# EasyEDA Pro project 基于ASM1153E的TYPEC接口的MSATA硬盘盒子.eprj, board PCB1_1
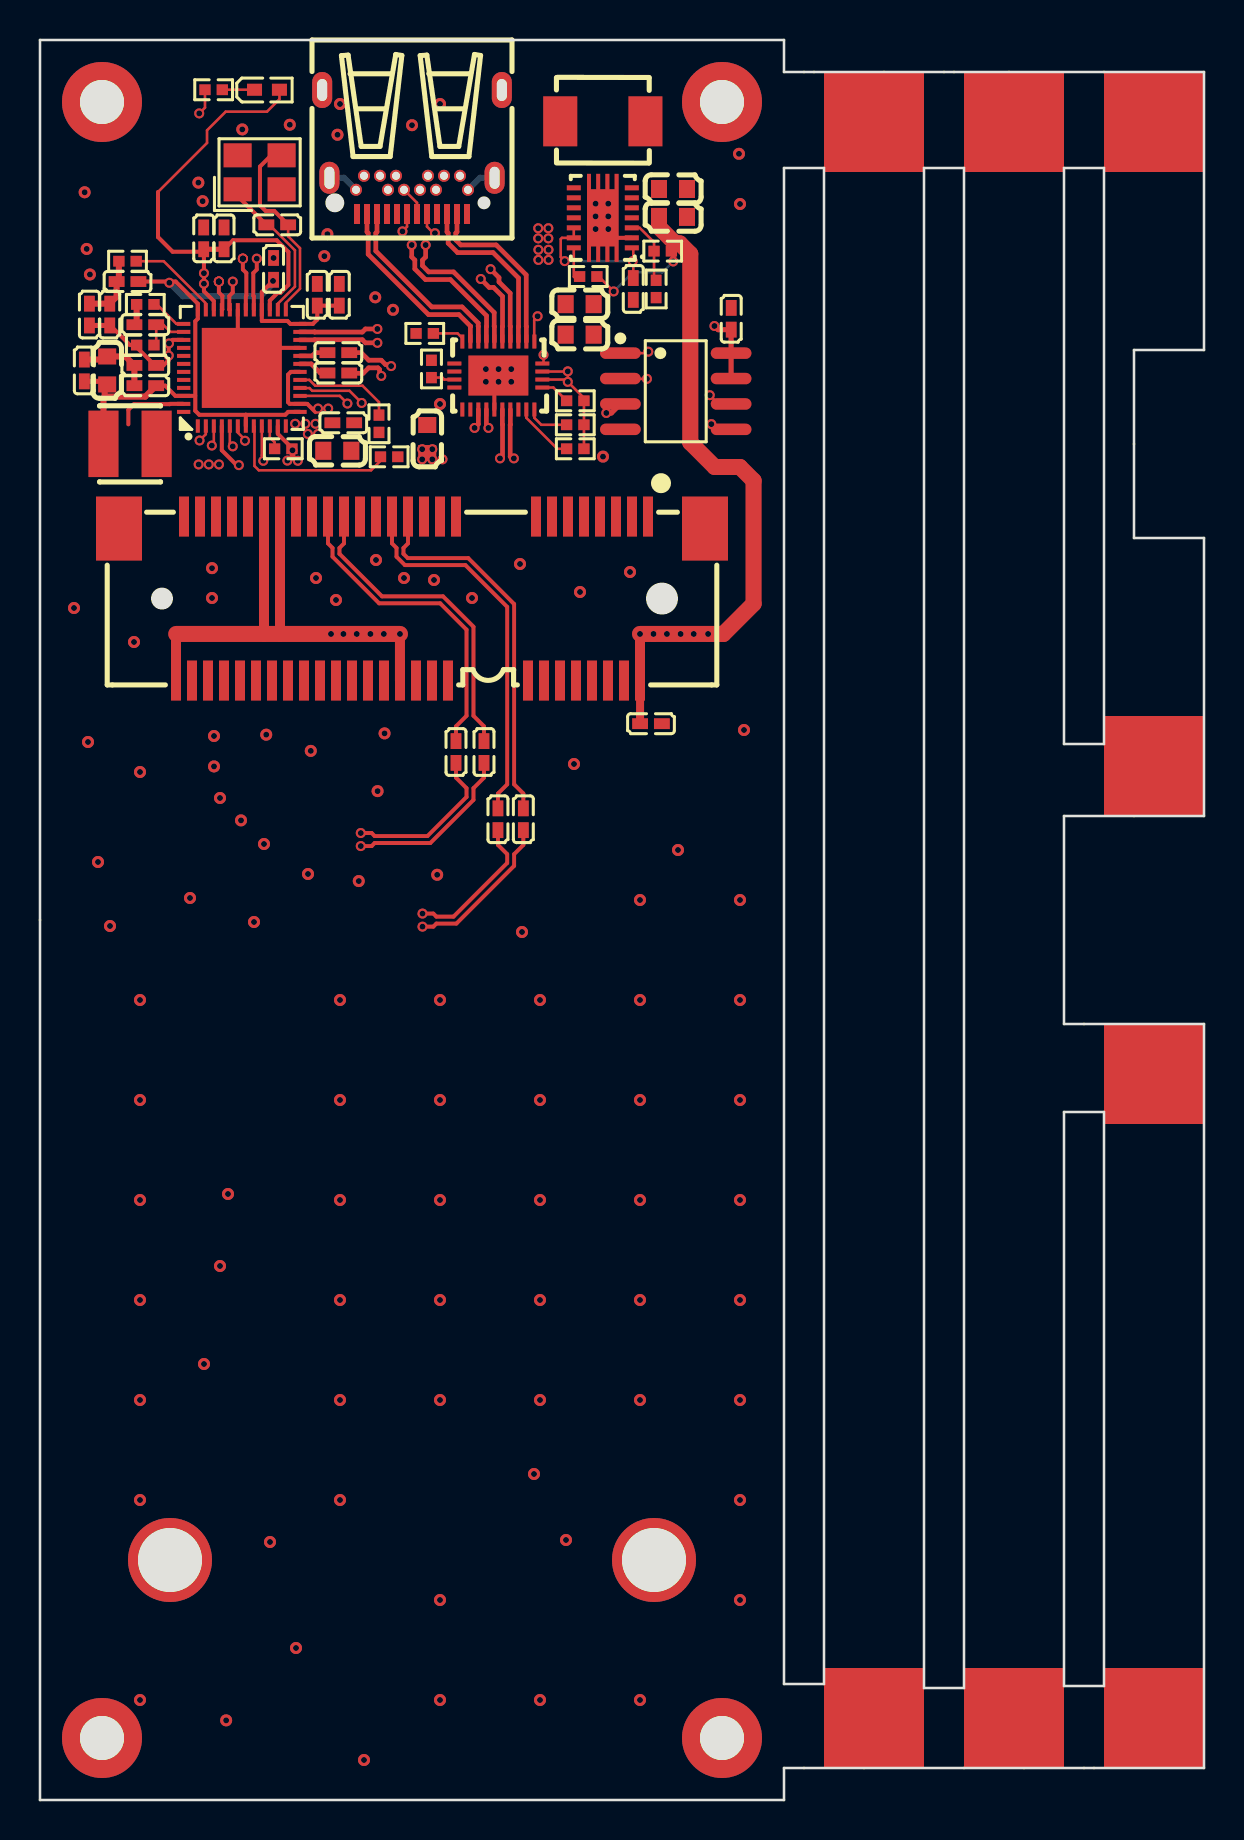
[diagram p5: board, top side]
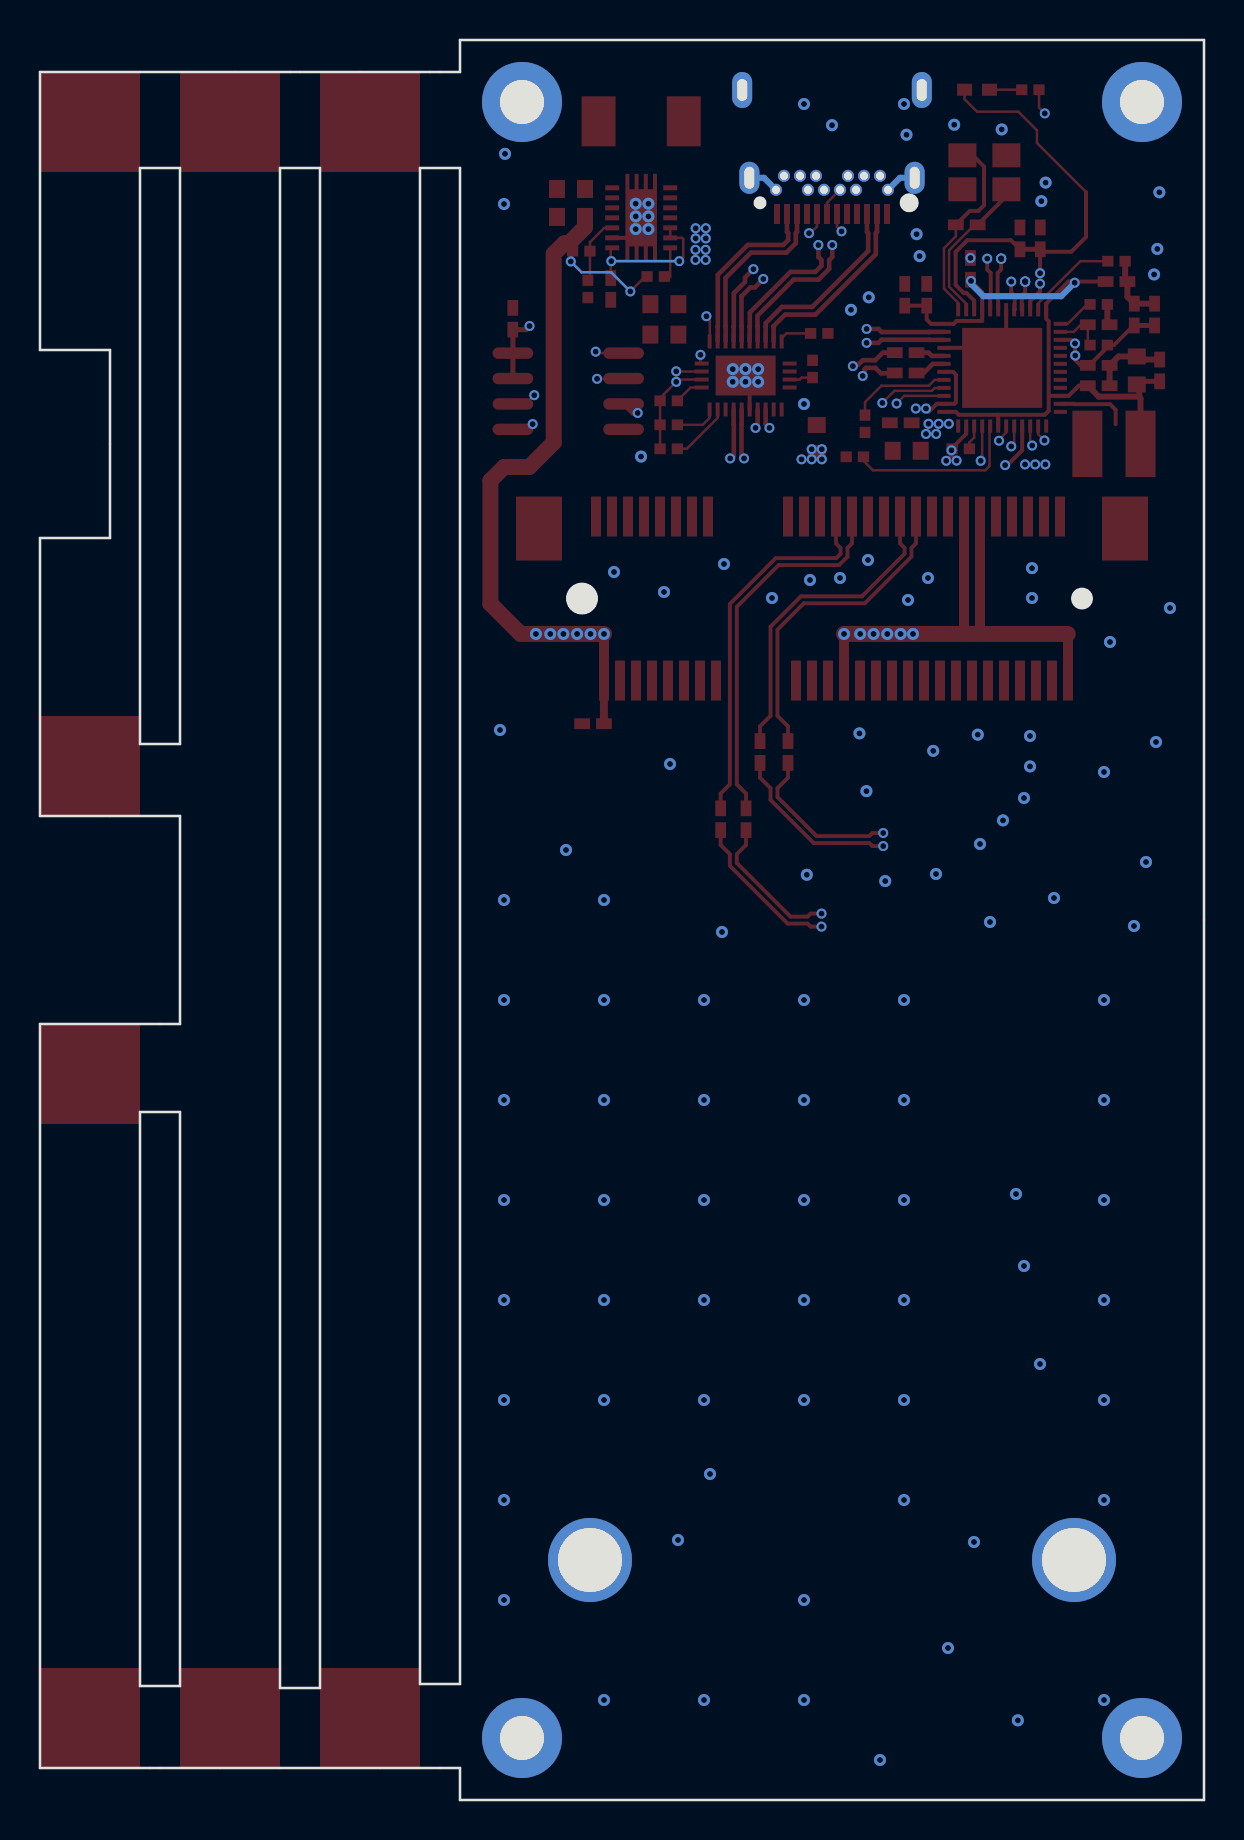
[diagram p6: board, bottom side, seen from below]

Outline 58.2 x 88 mm; copper layers: Top Layer, Inner1, Inner2, Bottom Layer. Coordinates in mm from the lower left corner of the outline.
Outline path: 0,88 0,0 37.2,0 37.2,1.6 58.2,1.6 58.2,38.8 51.2,38.8 51.2,49.2 58.2,49.2 58.2,63.1 54.7,63.1 54.7,72.5 58.2,72.5 58.2,86.4 37.2,86.4 37.2,88 0,88 ; 37.2,81.6 37.2,5.8 39.2,5.8 39.2,81.6 37.2,81.6 ; 44.2,81.6 44.2,5.6 46.2,5.6 46.2,81.6 44.2,81.6 ; 51.2,81.6 53.2,81.6 53.2,52.8 51.2,52.8 51.2,81.6 ; 51.2,34.4 53.2,34.4 53.2,5.7 51.2,5.7 51.2,34.4
Stack: Top Layer 0.035mm / Dielectric1 0.48mm PP er 4.5 / Inner1 0.035mm / Dielectric2 0.48mm FR4 er 4.5 / Inner2 0.035mm / Dielectric3 0.48mm PP er 4.5 / Bottom Layer 0.035mm

## Design rules (mm)
net SSTX_P: DP7
net SSTX_N: DP7
net SSRX_P: DP5
net SSRX_N: DP5
net RX2_P: DP1
net RX2_N: DP1
net RX1_N: DP3
net RX1_P: DP3
net TX2_P: DP4
net TX2_N: DP4
net TX1_N: DP2
net TX1_P: DP2
net CHIP_SSTX_N: DP6
net CHIP_SSTX_P: DP6
net CHIP_SATA_RX_P: DP9
net CHIP_SATA_RX_N: DP9
net CHIP_SATA_TX_N: DP8
net CHIP_SATA_TX_P: DP8
net SATA_TX_P: DP10
net SATA_TX_N: DP10
net SATA_RX_N: DP12
net SATA_RX_P: DP12
spacing safeClearance (default): track to track 0.127, other pairs 0 to 0.127
track width trackWidth (default): min 0.127, default 0.254, max 2.54
differential pair differentialPair (default): width min 0.127, default 0.254, max 2.54; gap min 0.152, default 0.152
via viaSize (default): diameter min 0.5, default 0.61, max 10; hole min 0.3, default 0.305, max 6
net GND uses 地发散

## Placement (name value [footprint] x y rotation side)
C1  100nF  [C0402]  13.86 75.26 90 top
C2  100nF  [C0402]  11.68 76.56 90 top
C3  100nF  [C0402]  5.27 70.72 180 top
C4  100nF  [C0402]  2.22 71.48 90 top
C5  100nF  [C0402]  4.38 75.92 180 top
C6  100nF  [C0402]  14.96 75.26 90 top
C7  100nF  [C0402]  2.47 74.27 90 top
C8  100nF  [C0402]  3.49 74.27 90 top
C9  100nF  [C0402]  8.19 78.08 90 top
C10  100nF  [C0402]  9.2 78.08 90 top
C11  100nF  [C0402]  34.56 74.06 90 top
C12  100nF  [C0402]  5.27 71.73 180 top
C14  10uF  [C0603]  3.36 71.48 270 top
C15  10uF  [C0603]  14.86 67.46 180 top
C16  10uF  [C0603]  19.36 68.05 270 top
C17  100nF  [C0402]  14.92 72.37 0 top
C18  100nF  [C0402]  14.92 71.35 0 top
C19  100nF  [C0402]  20.8 52.4 90 top
C20  100nF  [C0402]  22.2 52.4 90 top
C21  100nF  [C0402]  22.9 49.04 90 top
C22  100nF  [C0402]  24.17 49.04 90 top
C23  1uF  [C0402]  5.27 73.76 0 top
C24  10pF  [C0402]  11.86 78.76 0 top
C25  100nF  [C0402]  15.16 68.86 0 top
C26  100nF  [C0402]  29.66 75.55 90 top
C27  100nF  [C0402]  30.55 53.82 180 top
C28  22uF  [C0603]  31.65 80.55 180 top
C29  22uF  [C0603]  31.65 79.15 180 top
C30  22uF  [C0603]  26.98 73.27 180 top
C31  22uF  [C0603]  26.98 74.79 180 top
L1  4.7uH  [IND-SMD_L3.0-W3.0-1]  4.5 67.81 180 top
L2  1.5uH  [IND-SMD_L4.8-W4.2]  28.14 83.93 180 top
LED1  VLMW1500-GS08  [LED0402-R-RD_WHITE]  11.35 85.51 0 top
NOREF  -  [Pad_e8294]  48.7 83.9 270 top
NOREF#2  -  [Pad_e8292]  41.7 4.1 90 top
NOREF#3  -  [Pad_e3162]  3.1 84.9 180 top
NOREF#4  -  [Pad_e4877]  34.1 3.1 0 top
NOREF#5  -  [Pad_e6]  30.7 12 0 top
NOREF#6  -  [Pad_e8279]  55.7 83.9 270 top
NOREF#7  -  [Pad_e8272]  55.7 36.3 270 top
NOREF#8  -  [Pad_e4876]  3.1 3.1 270 top
NOREF#9  -  [Pad_e3101]  34.1 84.9 90 top
NOREF#10  -  [Pad_e8291]  48.7 4.1 90 top
NOREF#11  -  [Pad_e8278]  55.7 51.7 90 top
NOREF#12  -  [Pad_e2]  6.5 12 0 top
NOREF#13  -  [Pad_e8293]  41.7 83.9 270 top
NOREF#14  -  [Pad_e8277]  55.7 4.1 90 top
R1  20.5kΩ  [R0402]  19.24 73.33 0 top
R2  10kΩ  [R0402]  19.57 71.55 270 top
R3  10kΩ  [R0402]  26.76 69.96 180 top
R4  10kΩ  [R0402]  26.76 68.76 180 top
R5  10kΩ  [R0402]  26.76 67.56 180 top
R6  1MΩ  [R0402]  27.41 76.17 0 top
R7  1MΩ  [R0402]  31.14 77.44 0 top
R8  100kΩ  [R0402]  12.16 67.56 180 top
R11  4.7kΩ  [R0402]  4.38 76.94 180 top
R12  4.7kΩ  [R0402]  5.27 74.78 180 top
R13  4.7kΩ  [R0402]  17.46 67.16 0 top
R14  12.1kΩ  [R0402]  16.95 68.81 90 top
R15  1kΩ  [R0402]  8.68 85.51 0 top
R16  100kΩ  [R0402]  5.27 72.75 180 top
R17  180kΩ  [R0402]  30.81 75.55 90 top
U1  VL160  [MQFN-28_L4.5-W3.5-P0.40-BL-EP]  22.92 71.22 180 top
U2  ASM1153E  [QFN-48_L6.0-W6.0-P0.40-BL-EP4.2]  10.09 71.6 0 top
U3  PCIE-52P70H  [PCIE-SMD_52P-P0.80_PCIE-52PXXH]  18.6 60.07 180 top
U4  MX25L512EMI-10G  [SOP-8_L5.0-W4.0-P1.27-LS6.0-BL]  31.79 70.44 270 top
U5  TPS63020DSJR  [VSON-14_L4.0-W3.0-P0.50-BL-EP_TI_DSJ]  28.14 79.11 90 top
USB1  U262-241N-4BV60  [USB-C-SMD_U262-241N-4BV60]  18.6 82.4 180 top
X1  25MHz  [CRYSTAL-SMD_4P-L3.2-W2.5-BL]  10.98 81.38 0 top

## Footprints (pads in the part's own frame, mm; a bottom-side part is the same pattern mirrored in y, then rotated)
C0402
  rect 0.79x0.54 smd: 1(-0.545,0) 2(0.545,0)
C0603
  rect 0.8x0.9 smd: 1(-0.7,0) 2(0.7,0)
CRYSTAL-SMD_4P-L3.2-W2.5-BL
  rect 1.4x1.2 smd: 1(-1.1,-0.85) 2(1.1,-0.85) 3(1.1,0.85) 4(-1.1,0.85)
IND-SMD_L3.0-W3.0-1
  rect 1.501x3.32 smd: 1(1.329,0) 2(-1.329,0)
IND-SMD_L4.8-W4.2
  rect 1.7x2.499 smd: 1(-2.131,0) 2(2.128,0)
LED0402-R-RD_WHITE
  rect 0.75x0.6 smd: 1(0.623,0) 2(-0.623,0)
MQFN-28_L4.5-W3.5-P0.40-BL-EP
  rect 0.201x0.701 smd: 1(-1.801,-1.7) 2(-1.399,-1.7) 3(-1.001,-1.7) 4(-0.6,-1.7) 5(-0.201,-1.7) 6(0.201,-1.7) 7(0.6,-1.7) 8(1.001,-1.7) 9(1.399,-1.7) 10(1.801,-1.7) 15(1.801,1.7) 16(1.399,1.7) 17(1.001,1.7) 18(0.6,1.7) 19(0.201,1.7) 20(-0.201,1.7) 21(-0.6,1.7) 22(-1.001,1.7) 23(-1.399,1.7) 24(-1.801,1.7)
  rect 0.701x0.201 smd: 11(2.2,-0.6) 12(2.2,-0.201) 13(2.2,0.201) 14(2.2,0.6) 25(-2.2,0.6) 26(-2.2,0.201) 27(-2.2,-0.201) 28(-2.2,-0.6)
  rect 2.999x1.999 smd: 29(0,0)
Pad_e2
  round 4.2 hole 3.2: 1(0,0)
Pad_e6
  round 4.2 hole 3.2: 2(0,0)
Pad_e3101
  round 4 hole 2.2: 3(0,0)
Pad_e3162
  round 4 hole 2.2: 4(0,0)
Pad_e4876
  round 4 hole 2.2: 4(0,0)
Pad_e4877
  round 4 hole 2.2: 3(0,0)
Pad_e8272
  rect 5x5 smd: 16(0,0)
Pad_e8277
  rect 5x5 smd: 15(0,0)
Pad_e8278
  rect 5x5 smd: 14(0,0)
Pad_e8279
  rect 5x5 smd: 15(0,0)
Pad_e8291
  rect 5x5 smd: 16(0,0)
Pad_e8292
  rect 5x5 smd: 17(0,0)
Pad_e8293
  rect 5x5 smd: 18(0,0)
Pad_e8294
  rect 5x5 smd: 19(0,0)
PCIE-SMD_52P-P0.80_PCIE-52PXXH
  rect 0.5x2 smd: 1(-11.8,-4.1) 2(-11.4,4.1) 3(-11,-4.1) 4(-10.6,4.1) 5(-10.2,-4.1) 6(-9.8,4.1) 7(-9.4,-4.1) 8(-9,4.1) 9(-8.6,-4.1) 10(-8.2,4.1) 11(-7.8,-4.1) 12(-7.4,4.1) 13(-7,-4.1) 14(-6.6,4.1) 15(-6.2,-4.1) 16(-5.8,4.1) 17(-2.2,-4.1) 18(-1.8,4.1) 19(-1.4,-4.1) 20(-1,4.1) 21(-0.6,-4.1) 22(-0.2,4.1) 23(0.2,-4.1) 24(0.6,4.1) 25(1,-4.1) 26(1.4,4.1) 27(1.8,-4.1) 28(2.2,4.1) 29(2.6,-4.1) 30(3,4.1) 31(3.4,-4.1) 32(3.8,4.1) 33(4.2,-4.1) 34(4.6,4.1) 35(5,-4.1) 36(5.4,4.1) 37(5.8,-4.1) 38(6.2,4.1) 39(6.6,-4.1) 40(7,4.1) 41(7.4,-4.1) 42(7.8,4.1) 43(8.2,-4.1) 44(8.6,4.1) 45(9,-4.1) 46(9.4,4.1) 47(9.8,-4.1) 48(10.2,4.1) 49(10.6,-4.1) 50(11,4.1) 51(11.4,-4.1) 52(11.8,4.1)
  rect 2.3x3.2 smd: 53(14.65,-3.5) 54(-14.65,-3.5)
QFN-48_L6.0-W6.0-P0.40-BL-EP4.2
  rect 0.2x0.665 smd: 1(-2.2,-2.908) 2(-1.8,-2.908) 3(-1.4,-2.908) 4(-1,-2.908) 5(-0.6,-2.908) 6(-0.2,-2.908) 7(0.2,-2.908) 8(0.6,-2.908) 9(1,-2.908) 10(1.4,-2.908) 11(1.8,-2.908) 12(2.2,-2.908) 25(2.2,2.908) 26(1.8,2.908) 27(1.4,2.908) 28(1,2.908) 29(0.6,2.908) 30(0.2,2.908) 31(-0.2,2.908) 32(-0.6,2.908) 33(-1,2.908) 34(-1.4,2.908) 35(-1.8,2.908) 36(-2.2,2.908)
  rect 0.665x0.2 smd: 13(2.908,-2.2) 14(2.908,-1.8) 15(2.908,-1.4) 16(2.908,-1) 17(2.908,-0.6) 18(2.908,-0.2) 19(2.908,0.2) 20(2.908,0.6) 21(2.908,1) 22(2.908,1.4) 23(2.908,1.8) 24(2.908,2.2) 37(-2.908,2.2) 38(-2.908,1.8) 39(-2.908,1.4) 40(-2.908,1) 41(-2.908,0.6) 42(-2.908,0.2) 43(-2.908,-0.2) 44(-2.908,-0.6) 45(-2.908,-1) 46(-2.908,-1.4) 47(-2.908,-1.8) 48(-2.908,-2.2)
  rect 4x4 smd: 49(0,0)
R0402
  rect 0.566x0.54 smd: 1(-0.433,0) 2(0.433,0)
SOP-8_L5.0-W4.0-P1.27-LS6.0-BL
  oval 0.574x2.035 smd: 1(-1.905,-2.768) 2(-0.635,-2.768) 3(0.635,-2.768) 4(1.905,-2.768) 5(1.905,2.768) 6(0.635,2.768) 7(-0.635,2.768) 8(-1.905,2.768)
USB-C-SMD_U262-241N-4BV60
  oval 1x1.6 hole 0.5x1.1: 1(-4.13,1.29) 4(4.13,1.29)
  oval 1x1.8 hole 0.5x1.1: 2(-4.49,-3.1) 3(4.49,-3.1)
  rect 0.3x1 smd: A1(-2.75,3.1) A2(-2.25,3.1) A3(-1.75,3.1) A4(-1.25,3.1) A5(-0.75,3.1) A6(-0.25,3.1) A7(0.25,3.1) A8(0.75,3.1) A9(1.25,3.1) A10(1.75,3.1) A11(2.25,3.1) A12(2.75,3.1)
  round 0.6 hole 0.4: B1(2.8,1.89) B2(2.4,1.19) B3(1.6,1.19) B4(1.2,1.89) B5(0.799,1.19) B6(0.4,1.89) B7(-0.4,1.89) B8(-0.8,1.19) B9(-1.2,1.89) B10(-1.6,1.19) B11(-2.4,1.19) B12(-2.8,1.89)
VSON-14_L4.0-W3.0-P0.50-BL-EP_TI_DSJ
  rect 0.25x0.7 smd: 1(-1.5,-1.45) 2(-1,-1.45) 3(-0.5,-1.45) 4(0,-1.45) 5(0.5,-1.45) 6(1,-1.45) 7(1.5,-1.45) 8(1.5,1.45) 9(1,1.45) 10(0.5,1.45) 11(0,1.45) 12(-0.5,1.45) 13(-1,1.45) 14(-1.5,1.45)
  custom 4.4x1.58 smd: 15(0,0)

## Nets
As in the schematic, except:
5V: C16.2 C30.2 C31.2 R3.1 R4.1 R5.1 R8.1 U1.26 U1.27 U2.1 U2.11 U5.10 U5.11 USB1.A4 USB1.A9 USB1.B4 USB1.B9
GND: C1.2 C2.2 C3.2 C4.2 C5.2 C6.2 C7.2 C8.2 C9.2 C10.2 C11.2 C12.2 C14.1 C15.1 C16.1 C23.1 C25.2 C26.1 C27.1 C28.1 C29.1 C30.1 C31.1 NOREF.19 NOREF#2.17 NOREF#3.4 NOREF#4.3 NOREF#5.2 NOREF#6.15 NOREF#7.16 NOREF#8.4 NOREF#9.3 NOREF#10.16 NOREF#11.14 NOREF#12.1 NOREF#13.18 NOREF#14.15 R1.1 R2.1 R11.2 R12.2 R13.2 R14.1 R17.1 U1.19 U1.29 U2.21 U2.31 U2.47 U2.49 U3.4 U3.9 U3.15 U3.18 U3.21 U3.26 U3.27 U3.29 U3.34 U3.35 U3.37 U3.40 U3.43 U3.50 U3.53 U3.54 U4.4 U5.2 U5.15 USB1.1 USB1.2 USB1.3 USB1.4 USB1.A1 USB1.A12 USB1.B1 USB1.B12 X1.2 X1.4

Pads without a net: U1 11 12 14 15 16 22; U2 40 41 42 43 44 45; U3 1 3 5 6 7 8 10 11 12 13 14 16 17 19 20 22 28 30 32 36 38 42 44 45 46 47 48 49 51; USB1 A8 B8

## Via types
v1: diameter 0.6, hole 0.3, Top Layer to Bottom Layer, 128 vias
v2: diameter 0.5, hole 0.3, Top Layer to Bottom Layer, 85 vias

## Routing (per net, layer and track width the routed paths; a pad name or vN(x,y) marks a point on that pad's centre or on a via; arc(x,y) is an arc through that point)
3V3: length 65.9
  Top Layer w0.127: R6.2 27.94,76.17 v2(28.68,75.43)
  Top Layer w0.254: R7.2 31.66,77.35 v2(31.66,76.93)
  Top Layer w0.4: C27.2 30,55.97 U3.2
  Top Layer w0.5: U3.2 v1(30,58.3) ; U3.41 11.2,58.3 11.2,58.3 ; 6.81,58.3 6.8,58.29 U3.52 ; v1(18,58.3) 18,55.97 U3.24 ; 11.99,58.3 12,58.31 U3.39
  Top Layer w0.8: 6.81,58.3 v1(14.55,58.3) v1(15.17,58.3) v1(15.84,58.3) v1(16.52,58.3) v1(17.19,58.3) v1(18,58.3) ; C29.2 30.95,78.64 31.76,77.83 31.99,77.83 32.51,77.31 32.51,67.87 33.73,66.65 34.99,66.65 35.68,65.97 35.68,59.81 34.17,58.3 v1(33.4,58.3) v1(32.69,58.3) v1(32.03,58.3) v1(31.35,58.3) v1(30.67,58.3) v1(30,58.3)
  Bottom Layer w0.127: v2(28.68,75.43) 29.64,76.39 31.12,76.39 v2(31.66,76.93)
5V: length 9.3
  Top Layer w0.127: R5.1 R4.1 R3.1 27.2,70.1 v2(26.39,70.91) ; U1.27 26.38,71.42 v2(26.39,71.43) v2(26.39,70.91) ; v2(26.39,70.91) 26.27,71.02 U1.26
  Top Layer w0.2: v2(12.37,66.97) 12.62,67.23 ; v2(12.89,66.96) 12.62,67.23 v2(12.62,67.48) 12.62,67.57 11.89,68.31 U2.11
  vias: v2(7.93,66.78) v2(8.44,66.78) v2(8.95,66.78) v2(19.11,67.54) v2(19.11,67.03) v2(19.62,67.54) v2(19.62,67.03) v2(20.12,67.03) v2(24.91,78.59) v2(24.91,78.08) v2(24.92,77.51) v2(24.92,77) v2(25.42,78.59) v2(25.42,78.08) v2(25.43,77.51) v2(25.43,77)
GND: length 24.2
  Top Layer w0.2: U2.47 6.5,69.8 6.49,69.79 4.7,69.79 4.42,69.51 4.42,68.78 ; U1.29 22.72,71.02 U1.19 ; 28.52,78.47 28.89,78.11 U5.2 ; U2.21 11.09,72.6 U2.49 9.89,71.8 U2.31
  Top Layer w0.3: R12.2 4.83,73.88 C23.1 ; C3.2 C12.2 4.27,72.18 C14.1 3.2,72.02 C4.2 ; C7.2 C8.2 3.83,75.16 C5.2 3.94,76.04 3.94,76.94
  Bottom Layer w0.3: USB1.1 22,81.11 USB1.B12 ; USB1.B1 15.2,81.11 USB1.4
  vias: v1(1.7,59.6) v1(2.23,80.39) v1(2.33,77.55) v1(2.4,52.9) v1(2.5,76.28) v1(2.9,46.9) v1(3.5,43.7) v1(4.7,57.9) v1(5,51.4) v1(5,40) v1(5,35) v1(5,30) v1(5,25) v1(5,20) v1(5,15) v1(5,5) v1(7.5,45.1) v1(7.92,80.87) v1(8.13,79.94) v1(8.2,21.8) v1(8.6,61.59) v1(8.6,60.1) v1(8.7,53.2) v1(8.7,51.68) v1(9,50.1) v1(9,26.7) v1(9.31,3.98) v1(9.4,30.3) v1(10.11,83.53) v1(10.05,48.98) v1(10.7,43.9) v1(11.2,47.8) v1(11.31,53.27) v1(11.5,12.9) v1(12.49,83.76) v1(12.8,7.6) v1(13.4,46.3) v1(13.54,52.46) v1(13.8,61.1) v1(14.22,77.19) v1(14.37,78.29) v1(14.8,60) v1(14.87,83.26) v1(15,84.8) v1(15,40) v1(15,35) v1(15,30) v1(15,25) v1(15,20) v1(15,15) v1(15.94,45.95) v1(16.2,2) v1(16.76,75.13) v1(16.8,62) v1(16.88,50.44) v1(17.23,53.33) v1(17.65,74.51) v1(18.2,61.1) v1(18.6,83.74) v1(19.7,61) v1(19.86,46.26) v1(20,84.8) v1(20,69.8) v1(20,40) v1(20,35) v1(20,30) v1(20,25) v1(20,20) v1(20,10) v1(20,5) v1(21.6,60.1) v1(22.29,71.54) v1(22.29,70.91) v1(22.93,71.54) v1(22.93,70.91) v1(23.56,71.54) v1(23.56,70.91) v1(24,61.8) v1(24.1,43.4) v1(24.7,16.3) v1(25,40) v1(25,35) v1(25,30) v1(25,25) v1(25,20) v1(25,5) v1(26.3,13) v1(26.7,51.8) v1(27,60.4) v1(27.78,79.82) v1(27.78,79.18) v1(27.78,78.55) v1(28.15,67.17) v1(28.41,79.82) v1(28.41,79.18) v1(28.41,78.55) v1(29.5,61.4) v1(30,45) v1(30,40) v1(30,35) v1(30,30) v1(30,25) v1(30,20) v1(30,5) v1(31.9,47.5) v1(34.95,82.31) v1(35,79.8) v1(35,45) v1(35,40) v1(35,35) v1(35,30) v1(35,25) v1(35,20) v1(35,15) v1(35,10) v1(35.2,53.5) v2(11.68,77.1)
VBUS_DET: length 1.2
  Top Layer w0.127: R8.2 11.73,67.88 11.49,68.12 U2.10
VCC12: length 36.5
  Top Layer w0.2: 10.29,69.26 7.96,69.26 7.76,69.46 7.76,73.94 7.89,74.06 U2.36 7.89,74.81 6.78,75.92 C5.1 ; 10.29,69.26 10.29,69.26 U2.7 ; 10.29,69.26 12.26,69.26 12.41,69.4 U2.13 ; 7.76,70.2 U2.46 6.77,70.2 6.26,70.72 C3.1 ; C2.1 11.68,75.98 v2(11.65,75.95) 11.09,75.39 U2.28 11.09,73.96 11.1,73.95 12.37,73.95 12.52,73.8 13,73.8 U2.24 13.64,73.8 13.86,74.02 C1.1 C6.1
  Top Layer w0.254: C4.1 3.08,70.93 3.23,70.78
  Top Layer w0.3: C3.1 5.26,70.17 3.26,70.17 3.23,70.14 ; 3.17,68.05 3.17,70.08 3.23,70.14 ; 3.23,70.14 3.23,70.78
  Bottom Layer w0.3: v2(11.65,75.95) 11.65,75.81 11.03,75.19 7.14,75.19 v2(6.47,75.86)
VCC33: length 66.1
  Top Layer w0.127: 5.9,80.4 8.35,82.85 8.35,83.48 9.28,84.42 11.35,84.42 11.97,85.04 LED1.1
  Top Layer w0.2: 3.52,73.73 4.5,72.75 R16.2 4.83,72.64 5.74,71.73 C12.1 6.17,71.73 6.44,72 v2(6.44,72.22) 6.44,72.81 v2(6.45,72.83) 6.63,73 U2.39 ; U2.34 8.69,74.95 8.2,75.44 v2(8.2,75.81) v2(8.2,76.34) 8.2,77.53 C9.1 8.06,77.41 6.64,77.41 5.9,78.15 5.9,80.4 ; U2.18 12.54,71.4 12.4,71.26 12.4,69.89 12.49,69.8 U2.14 13.36,69.8 13.77,69.39 ; C10.1 9.65,77.99 11.83,77.99 12.42,77.4 12.42,75.75 12.02,75.36 11.88,75.36 11.49,74.97 U2.27 ; v2(9.94,66.74) 9.83,66.74 9.09,67.49 U2.4
  Top Layer w0.254: v2(33.72,73.7) 33.91,73.52 C11.1 34.55,73.51 U4.8 U4.7 ; 8.2,77.53 8.21,77.54 C10.1 ; C7.1 3.52,73.73 ; U4.3 28.57,69.35 v2(28.31,69.35)
  Inner1 w0.254: v2(13.9,68.3) 14.28,68.68 19.76,68.68 20.49,67.95 23.26,67.95 24.67,69.35 v2(28.31,69.35) 28.31,72.1 29.92,73.7 v2(33.72,73.7)
  vias: v2(12.76,68.81) v2(13.27,68.81) v2(13.39,68.3) v2(13.77,68.81) v2(13.9,69.57) v2(14.41,69.57)
CC1: length 10.3
  Top Layer w0.127: USB1.A5 19.35,78.67 19.67,78.34 v2(19.75,78.34) ; 24.72,72.92 24.71,72.93 24.71,73.99 24.88,74.16 v2(24.88,74.19)
  Inner1 w0.127: 24.88,74.19 24.72,74.35 24.72,75.96 22.56,78.11 19.98,78.11 v2(19.75,78.34)
CC2: length 17.3
  Top Layer w0.127: U1.28 25.18,71.88 v2(25.18,72.26)
  Inner1 w0.127: USB1.B5 18.43,81.84 21.2,81.84 21.6,82.24 23.36,82.24 23.95,81.65 23.95,77.08 24.97,76.06 24.97,74.72 25.32,74.37 25.32,72.4 v2(25.18,72.26)
CHIP_SATA_RX_N: length 59.8
  Top Layer w0.195: v2(19.12,44.32) 19.67,44.32 19.82,44.17 20.67,44.17 23.36,46.85 23.36,47.29 22.9,47.75 C21.1
  Top Layer w0.196: U2.30 10.29,75.19 10.32,75.21 10.32,76.35 10.14,76.52 v2(10.14,77.07)
  Inner2 w0.153: v2(19.12,44.32) 18.65,44.32 18.47,44.15 13.37,44.15 7.82,49.7 7.82,54.87 7.97,55.03 8.11,55.03 8.27,55.18 8.27,55.37 8.11,55.53 7.97,55.53 7.82,55.68 7.82,55.87 7.97,56.03 8.11,56.03 8.27,56.18 8.27,56.37 8.11,56.53 7.97,56.53 7.82,56.68 7.82,56.87 7.97,57.03 8.11,57.03 8.27,57.18 8.27,57.37 8.11,57.53 7.97,57.53 7.82,57.68 7.82,57.87 7.97,58.03 8.11,58.03 8.27,58.18 8.27,58.37 8.11,58.53 7.97,58.53 7.82,58.68 7.82,63.16 5.86,65.11 5.86,76.89 7.1,78.13 10.18,78.13 10.34,77.97 10.34,77.74 10.14,77.55 v2(10.14,77.07)
CHIP_SATA_RX_P: length 59.7
  Top Layer w0.195: C22.1 24.17,47.75 23.71,47.29 23.71,46.71 20.82,43.82 19.82,43.82 19.67,43.67 v2(19.12,43.67)
  Top Layer w0.196: v2(10.84,77.07) 10.84,76.52 10.67,76.35 10.67,75.21 10.69,75.19 U2.29
  Inner2 w0.153: v2(10.84,77.07) 10.84,77.55 10.64,77.74 10.64,78.1 10.3,78.44 6.97,78.44 5.56,77.02 5.56,64.99 7.51,63.03 7.51,49.57 13.24,43.84 18.47,43.84 18.65,43.67 v2(19.12,43.67)
CHIP_SATA_TX_N: length 48.6
  Top Layer w0.195: C20.1 22.2,51.12 21.67,50.59 21.67,50.01 19.52,47.85 16.73,47.85 16.58,47.7 v2(16.04,47.7)
  Top Layer w0.196: U2.32 9.48,74.51 9.46,74.53 9.46,75.2 9.64,75.38 v2(9.64,75.92)
  Inner2 w0.153: v2(9.64,75.92) 9.64,76.4 9.44,76.59 9.44,76.95 9.1,77.29 7.78,77.29 7.01,76.51 7.01,65.8 9.52,63.29 9.52,51 12.65,47.87 15.39,47.87 15.56,47.7 v2(16.04,47.7)
CHIP_SATA_TX_P: length 48.7
  Top Layer w0.195: C19.1 20.8,51.12 21.33,50.59 21.33,50.15 19.37,48.2 16.73,48.2 16.58,48.35 v2(16.04,48.35)
  Top Layer w0.196: U2.33 9.1,74.51 9.12,74.53 9.12,75.2 8.94,75.38 v2(8.94,75.92)
  Inner2 w0.153: v2(8.94,75.92) 8.94,76.4 9.14,76.59 9.14,76.82 8.98,76.99 7.91,76.99 7.31,76.39 7.31,65.93 9.82,63.42 9.82,58.73 9.98,58.58 10.21,58.58 10.36,58.42 10.36,58.23 10.21,58.08 9.98,58.08 9.82,57.92 9.82,57.73 9.98,57.58 10.21,57.58 10.36,57.42 10.36,57.23 10.21,57.08 9.98,57.08 9.82,56.92 9.82,56.73 9.98,56.58 10.21,56.58 10.36,56.42 10.36,56.23 10.21,56.08 9.98,56.08 9.82,55.92 9.82,51.13 12.78,48.17 15.39,48.17 15.56,48.35 v2(16.04,48.35)
CHIP_SSTX_N: length 1.6
  Top Layer w0.231: U2.19 13.56,71.8 14.01,71.35 C18.1
CHIP_SSTX_P: length 1.4
  Top Layer w0.231: C17.1 13.77,72.37 13.61,72.2 U2.20
D+: length 16.1
  Top Layer w0.127: USB1.A6 18.85,79.86 USB1.B6 ; v2(15.37,69.82) 14.99,70.2 U2.15
  Inner1 w0.127: USB1.B6 18.51,80.2 18.51,79.44 15.58,76.52 15.58,70.04 v2(15.37,69.82)
D-: length 16.6
  Top Layer w0.127: U2.16 13.01,70.6 13.48,70.6 13.61,70.46 15.48,70.46 v2(16.08,69.85) ; USB1.A7 18.35,78.66 v2(18.12,78.43)
  Inner1 w0.127: USB1.B7 18.76,80.27 18.76,79.32 18.12,78.68 v2(18.12,78.43) 17.87,78.43 15.84,76.4 15.84,70.1 v2(16.08,69.85)
GPIO2: length 25.4
  Top Layer w0.127: v2(11.16,66.96) 11.16,67.16 11.09,67.23 U2.9 ; v2(7.96,84.33) 8.25,84.62 R15.1
  Inner1 w0.127: v2(7.96,84.33) 7.46,83.83 7.46,82.9 5.18,80.61 5.18,76.61 4.93,76.36 4.93,72.28 8.19,69.01 10.08,69.01 11.16,67.93 v2(11.16,66.96)
GPIO3: length 8.8
  Top Layer w0.127: R13.1 17.02,66.96 16.55,66.49 10.94,66.49 10.72,66.7 10.72,68.66 U2.8
GPIO4: length 40.7
  Top Layer w0.127: v2(10.25,67.96) 10.25,68.01 9.89,68.37 U2.6 ; U4.1 30.34,72.34 v2(30.42,72.42)
  Inner1 w0.127: v2(30.42,72.42) 30.79,72.04 30.79,70.87 30.41,70.5 30.41,67.02 26.25,62.86 9.41,62.86 6.53,65.75 6.53,67.25 7.7,68.42 9.8,68.42 v2(10.25,67.96)
GPIO5: length 44.3
  Top Layer w0.127: v2(33.57,68.79) 33.83,68.53 34.55,68.53 ; U2.5 9.49,67.83 v2(9.64,67.68)
  Inner1 w0.127: v2(33.57,68.79) 33.93,69.16 33.93,72.18 33,73.11 30.13,73.11 29.65,72.64 29.65,67.34 25.94,63.63 9.73,63.63 7.29,66.06 7.29,66.93 7.58,67.22 9.18,67.22 v2(9.64,67.68)
GPIO6: length 1.9
  Top Layer w0.127: R12.1 5.84,74.78 6.82,73.8 U2.37
GPIO7: length 4.7
  Top Layer w0.127: U2.35 8.26,74.54 8.26,74.86 6.19,76.94 R11.1
I2C_CLK: length 42
  Top Layer w0.127: U2.3 8.69,67.82 v2(8.59,67.72) ; U4.6 33.93,69.8 v2(33.49,70.24)
  Inner1 w0.127: v2(8.59,67.72) 8.34,67.47 7.47,67.47 7.04,67.04 7.04,65.96 9.62,63.37 26.04,63.37 29.91,67.24 29.91,72.53 30.23,72.86 32.89,72.86 33.46,72.28 33.46,70.26 v2(33.49,70.24)
I2C_DATA: length 35.2
  Top Layer w0.127: U4.2 29.03,71.06 v2(30.35,71.06) ; v2(7.98,67.98) 8.29,68.29 U2.2
  Inner1 w0.127: v2(30.35,71.06) 30.16,70.87 30.16,67.13 26.15,63.12 9.52,63.12 6.78,65.85 6.78,67.15 7.62,67.98 v2(7.98,67.98)
RST#: length 2.6
  Top Layer w0.127: U2.38 6.52,73.4 6.16,73.76 C23.2 5.81,72.86 R16.1
RX1_N: length 11.9
  Top Layer w0.231: v2(18.59,77.75) 18.59,77.15 18.74,77 18.74,76.55 19.27,76.02 20.52,76.02 22.33,74.21 22.33,73.68 22.32,73.67 U1.7
  Inner2 w0.18: USB1.B10 20.29,81.21 20.43,81.08 20.43,79.93 19.84,79.35 19.08,79.35 18.78,79.04 18.78,77.94 v2(18.59,77.75)
RX1_P: length 11.9
  Top Layer w0.231: U1.6 22.72,73.67 22.71,73.68 22.71,74.37 20.68,76.4 19.43,76.4 19.13,76.71 19.13,77 19.28,77.15 v2(19.28,77.75)
  Inner2 w0.18: USB1.B11 20.87,81.21 20.76,81.1 20.76,79.79 19.98,79.01 19.22,79.01 19.11,78.9 19.11,77.92 v2(19.28,77.75)
RX2_N: length 9.4
  Top Layer w0.231: U1.8 21.92,73.67 21.91,73.68 21.91,73.85 21.11,74.65 19.58,74.65 16.79,77.45 16.79,78.34 16.85,78.4 USB1.A10
RX2_P: length 9.4
  Top Layer w0.231: U1.9 21.52,73.67 21.53,73.68 21.53,73.69 20.95,74.27 19.43,74.27 16.41,77.29 16.41,78.34 16.35,78.4 USB1.A11
SATA_RX_N: length 18.9
  Top Layer w0.195: C21.2 22.9,50.32 23.36,50.78 23.36,59.65 21.27,61.75 18.25,61.75 17.83,62.17 17.83,62.6 17.6,62.83 U3.25
SATA_RX_P: length 18.9
  Top Layer w0.195: C22.2 24.17,50.32 23.71,50.78 23.71,59.8 21.41,62.09 18.39,62.09 18.17,62.31 18.17,62.6 18.4,62.83 U3.23
SATA_TX_N: length 16.1
  Top Layer w0.195: C20.2 22.2,53.68 21.67,54.21 21.67,58.66 20.15,60.18 17.1,60.18 14.97,62.31 14.97,62.6 15.2,62.83 U3.31
SATA_TX_P: length 16.1
  Top Layer w0.195: U3.33 14.4,62.83 14.63,62.6 14.63,62.17 16.96,59.83 20.01,59.83 21.33,58.52 21.33,54.21 20.8,53.68 C19.2
SSRX_N: length 12.2
  Top Layer w0.231: U1.17 21.92,68.79 v2(21.73,68.6) ; U2.22 13.73,73 13.74,73.01 16.12,73.01 16.27,72.86 v2(16.87,72.86)
  Inner2 w0.18: v2(16.87,72.86) 17.41,72.86 17.59,73.04 17.87,73.04 21.9,69.01 21.9,68.68 21.82,68.6 v2(21.73,68.6)
SSRX_P: length 12.7
  Top Layer w0.231: v2(22.42,68.6) 22.32,68.71 U1.18 ; U2.23 13.73,73.4 13.74,73.4 16.12,73.4 16.27,73.55 v2(16.87,73.55)
  Inner2 w0.18: v2(22.42,68.6) 22.36,68.6 22.23,68.73 22.23,69.14 18.01,73.37 17.59,73.37 17.41,73.55 v2(16.87,73.55)
SSTX_N: length 12.6
  Top Layer w0.231: v2(17.06,71.2) 16.98,71.29 16.98,71.53 16.9,71.61 16.43,71.61 16.16,71.34 15.48,71.34 C18.2 ; U1.20 23.12,68.78 23.13,68.77 23.13,67.14 23.06,67.08 v2(23,67.08)
  Inner2 w0.18: v2(23,67.08) 23,67.14 23.18,67.31 22.87,67.62 20.89,67.62 17.68,70.82 17.45,70.82 v2(17.06,71.2)
SSTX_P: length 13.3
  Top Layer w0.231: v2(23.69,67.08) 23.6,67.08 23.51,67.17 23.51,68.77 23.52,68.78 U1.21 ; v2(17.56,71.69) 17.48,71.77 17.28,71.77 17.06,71.99 16.43,71.99 16.06,72.37 C17.2
  Inner2 w0.18: v2(17.56,71.69) 17.94,71.31 17.94,71.03 21.02,67.95 23.01,67.95 23.55,67.41 23.55,67.22 v2(23.69,67.08)
TX1_N: length 8.9
  Top Layer w0.231: U1.3 23.92,73.67 23.93,73.68 23.93,76.1 22.65,77.37 20.88,77.37 20.41,77.84 20.41,78.34 20.35,78.4 USB1.A3
TX1_P: length 8.9
  Top Layer w0.231: U1.2 24.32,73.67 24.31,73.68 24.31,76.26 22.81,77.75 21.04,77.75 20.79,78 20.79,78.34 20.85,78.4 USB1.A2
TX2_N: length 13.4
  Top Layer w0.231: v2(22.53,76.54) 22.95,76.12 22.95,75.9 23.51,75.34 23.51,73.68 23.52,73.67 U1.4
  Inner2 w0.18: USB1.B3 16.91,81.21 16.77,81.07 16.77,78.6 18.23,77.15 21.67,77.15 21.9,76.93 22.14,76.93 v2(22.53,76.54)
TX2_P: length 13.4
  Top Layer w0.231: U1.5 23.12,73.67 23.13,73.68 23.13,75.18 22.68,75.63 22.46,75.63 v2(22.04,76.05)
  Inner2 w0.18: v2(22.04,76.05) 21.65,76.43 21.65,76.7 21.54,76.81 18.09,76.81 16.44,78.46 16.44,81.11 16.34,81.21 USB1.B2
XI: length 9.8
  Top Layer w0.127: C24.2 12.41,78.18 13,77.59 13,75.56 12.29,74.85 U2.25
  Top Layer w0.2: X1.3 11.56,82.23 11,81.67 11,79.74 11.28,79.45 11.71,79.45 C24.2
XO: length 7.7
  Top Layer w0.127: 11.32,78.76 11.47,78.76 12.75,77.49 12.75,75.67 11.89,74.81 U2.26
  Top Layer w0.2: X1.1 9.88,80.2 11.32,78.76
$1N1444: length 1.7
  Top Layer w0.127: U1.10 21.12,73.09 20.88,73.33 19.67,73.33
$1N1618: length 1.2
  Top Layer w0.127: U1.13 20.21,71.02 20.12,71.12 R2.2
$1N2073: length 2.2
  Top Layer w0.127: 24.72,69.52 24.72,69.11 25.06,68.76 R4.2
$1N2189: length 3.1
  Top Layer w0.127: U1.23 24.32,69.11 25.86,67.56 R5.2
$1N2538: length 1.5
  Top Layer w0.127: U1.25 25.67,70.62 R3.2
$1N7039: length 5.1
  Top Layer w0.127: U2.17 13.47,71 13.76,70.71 16.13,70.71 16.95,69.89 R14.2
$1N7831: length 1.6
  Top Layer w0.127: R15.2 LED1.2
$1N14211: length 3.4
  Top Layer w0.127: U5.3 29.98,78.61 30.7,77.89 R7.1 30.7,76.09 R17.2
$1N14216: length 7.3
  Top Layer w0.127: U5.12 U5.13 26.1,78.11 26.04,78.05 26.04,77.14 v2(26.24,76.94) ; U5.1 29.66,77.53 29.66,76.94 ; C26.2 29.66,76.94 ; 29.66,76.94 v2(29.64,76.94)
  Bottom Layer w0.127: v2(26.24,76.94) v2(29.64,76.94)
$1N14218: length 1.5
  Top Layer w0.127: U5.14 26.69,76.16 26.74,76.11

## Copper pours and planes (outline as drawn; the poured copper is in the pictures)
3V3 on Top Layer: 29.04,79.84 29.04,78.84 30.14,78.84 30.74,78.24 31.45,78.24 31.66,78.46 31.66,81.07 32.04,81.44 32.74,81.44 32.84,81.54 32.84,82.34 32.64,82.54 31.85,82.54 30.26,80.95 30.26,80.07 30.04,79.84
3V3 on Bottom Layer: 14.03,58.79 14.15,58.92 33.84,58.92 33.97,58.79 33.97,57.77 33.84,57.65 14.28,57.65 14.03,57.9
5V on Top Layer: 26.24,79.82 27.12,79.82 27.22,79.73 27.22,78.96 27.11,78.86 26.35,78.86 25.84,78.35 25.84,76.47 26.99,75.32 26.99,72.85 26.7,72.56 25.73,72.56 25.42,72.87 25.42,74.69 24.72,75.4 24.72,76.32 24.23,76.81 24.23,79.15 24.82,79.74 26.16,79.74
5V on Top Layer: 9.2,66.48 9.2,67.16 8.44,67.16 8.06,67.54 8.06,68.94 7.93,69.06 7.76,69.06 6.86,68.17 6.86,66.84 7.23,66.48
5V on Top Layer: 19.62,78.72 20.12,78.72 20.12,79.99 20.25,80.11 20.25,80.62 20,80.88 19.62,80.88 19.36,80.62 19.36,80.24 19.62,79.99
5V on Top Layer: 17.08,78.72 17.58,78.72 17.58,79.82 17.8,80.04 17.8,80.66 17.58,80.88 17.2,80.88 16.95,80.62 16.95,80.11 17.08,79.99
5V on Bottom Layer: 25.94,75.54 25.94,78.79 25.42,79.31 21.81,79.31 20.25,80.88 17.08,80.88 16.57,80.37 16.57,79.35 17.2,78.72 19.87,78.72 21.52,77.07 22.79,77.07 24.31,75.54
5V on Bottom Layer: 25.46,76.79 25.46,67.79 24.19,66.52 21.9,66.52 20.63,67.79 11.11,67.79 10.47,67.16 7.75,67.16 7.38,66.79 7.38,65.17 7.55,65 20.78,65 21.6,64.18 24.89,64.18 27.36,66.65 27.36,75.29 25.86,76.79
GND on Top Layer: 0,88 61.45,88 61.45,0 0,0
GND on Bottom Layer: 0,88 61.47,88 61.47,0 0,0
GND on Inner1: 0,88 61.66,88 61.66,0 0,0
GND on Inner2: 0,88 61.59,88 61.59,0 0,0
VCC33 on Top Layer: 15.16,69.86 15.16,68.39 14.87,68.1 14.87,67.04 14.58,66.75 13.57,66.75 13.26,67.06 13.26,68.06 13.06,68.26 12.26,68.26 12.16,68.36 12.16,68.96 12.26,69.06 13.16,69.06 13.36,69.26 13.36,69.46 13.26,69.56 12.56,69.56 12.36,69.76 12.36,69.86 12.56,70.06 13.36,70.06 13.56,69.86
VCC33 on Inner1: 5.9,72.11 6.28,71.73 6.66,71.73 6.92,71.99 6.92,74.02 7.68,74.78 11.87,74.78 12.5,74.14 12.5,68.03 13.47,67.06 13.47,66.86 13.01,66.4 11.11,66.4 10.34,67.16 9.84,67.16 9.46,66.78 9.46,66.02 9.96,65.51 13.68,65.51 14.87,66.7 14.87,73.8 13.18,75.49 8.75,75.49 8.57,75.67 8.57,76.56 8.44,76.68 7.93,76.68 7.8,76.56 7.8,75.67 5.9,73.76
$1N7428 on Top Layer: 7.63,69.57 7.63,69.15 6.72,68.23 6.72,66.33 6.56,66.17 5.14,66.17 4.81,66.5 4.81,69.32 5.06,69.57
$1N14209 on Top Layer: 29.04,79.84 29.04,85.14 29.54,85.64 30.94,85.64 31.54,85.04 31.54,82.44 30.14,81.04 30.14,79.94 30.04,79.84
$1N14210 on Top Layer: 26.24,79.84 27.24,79.84 27.24,85.14 26.74,85.64 24.94,85.64 24.24,84.94 24.24,81.34 24.94,80.64 25.77,80.64 26.07,80.35 26.07,80.01

## Text on the board
Document Layer: 7628结构1.6mm板
